# EAGLE schematic schaltplan (EAGLE 6.4)
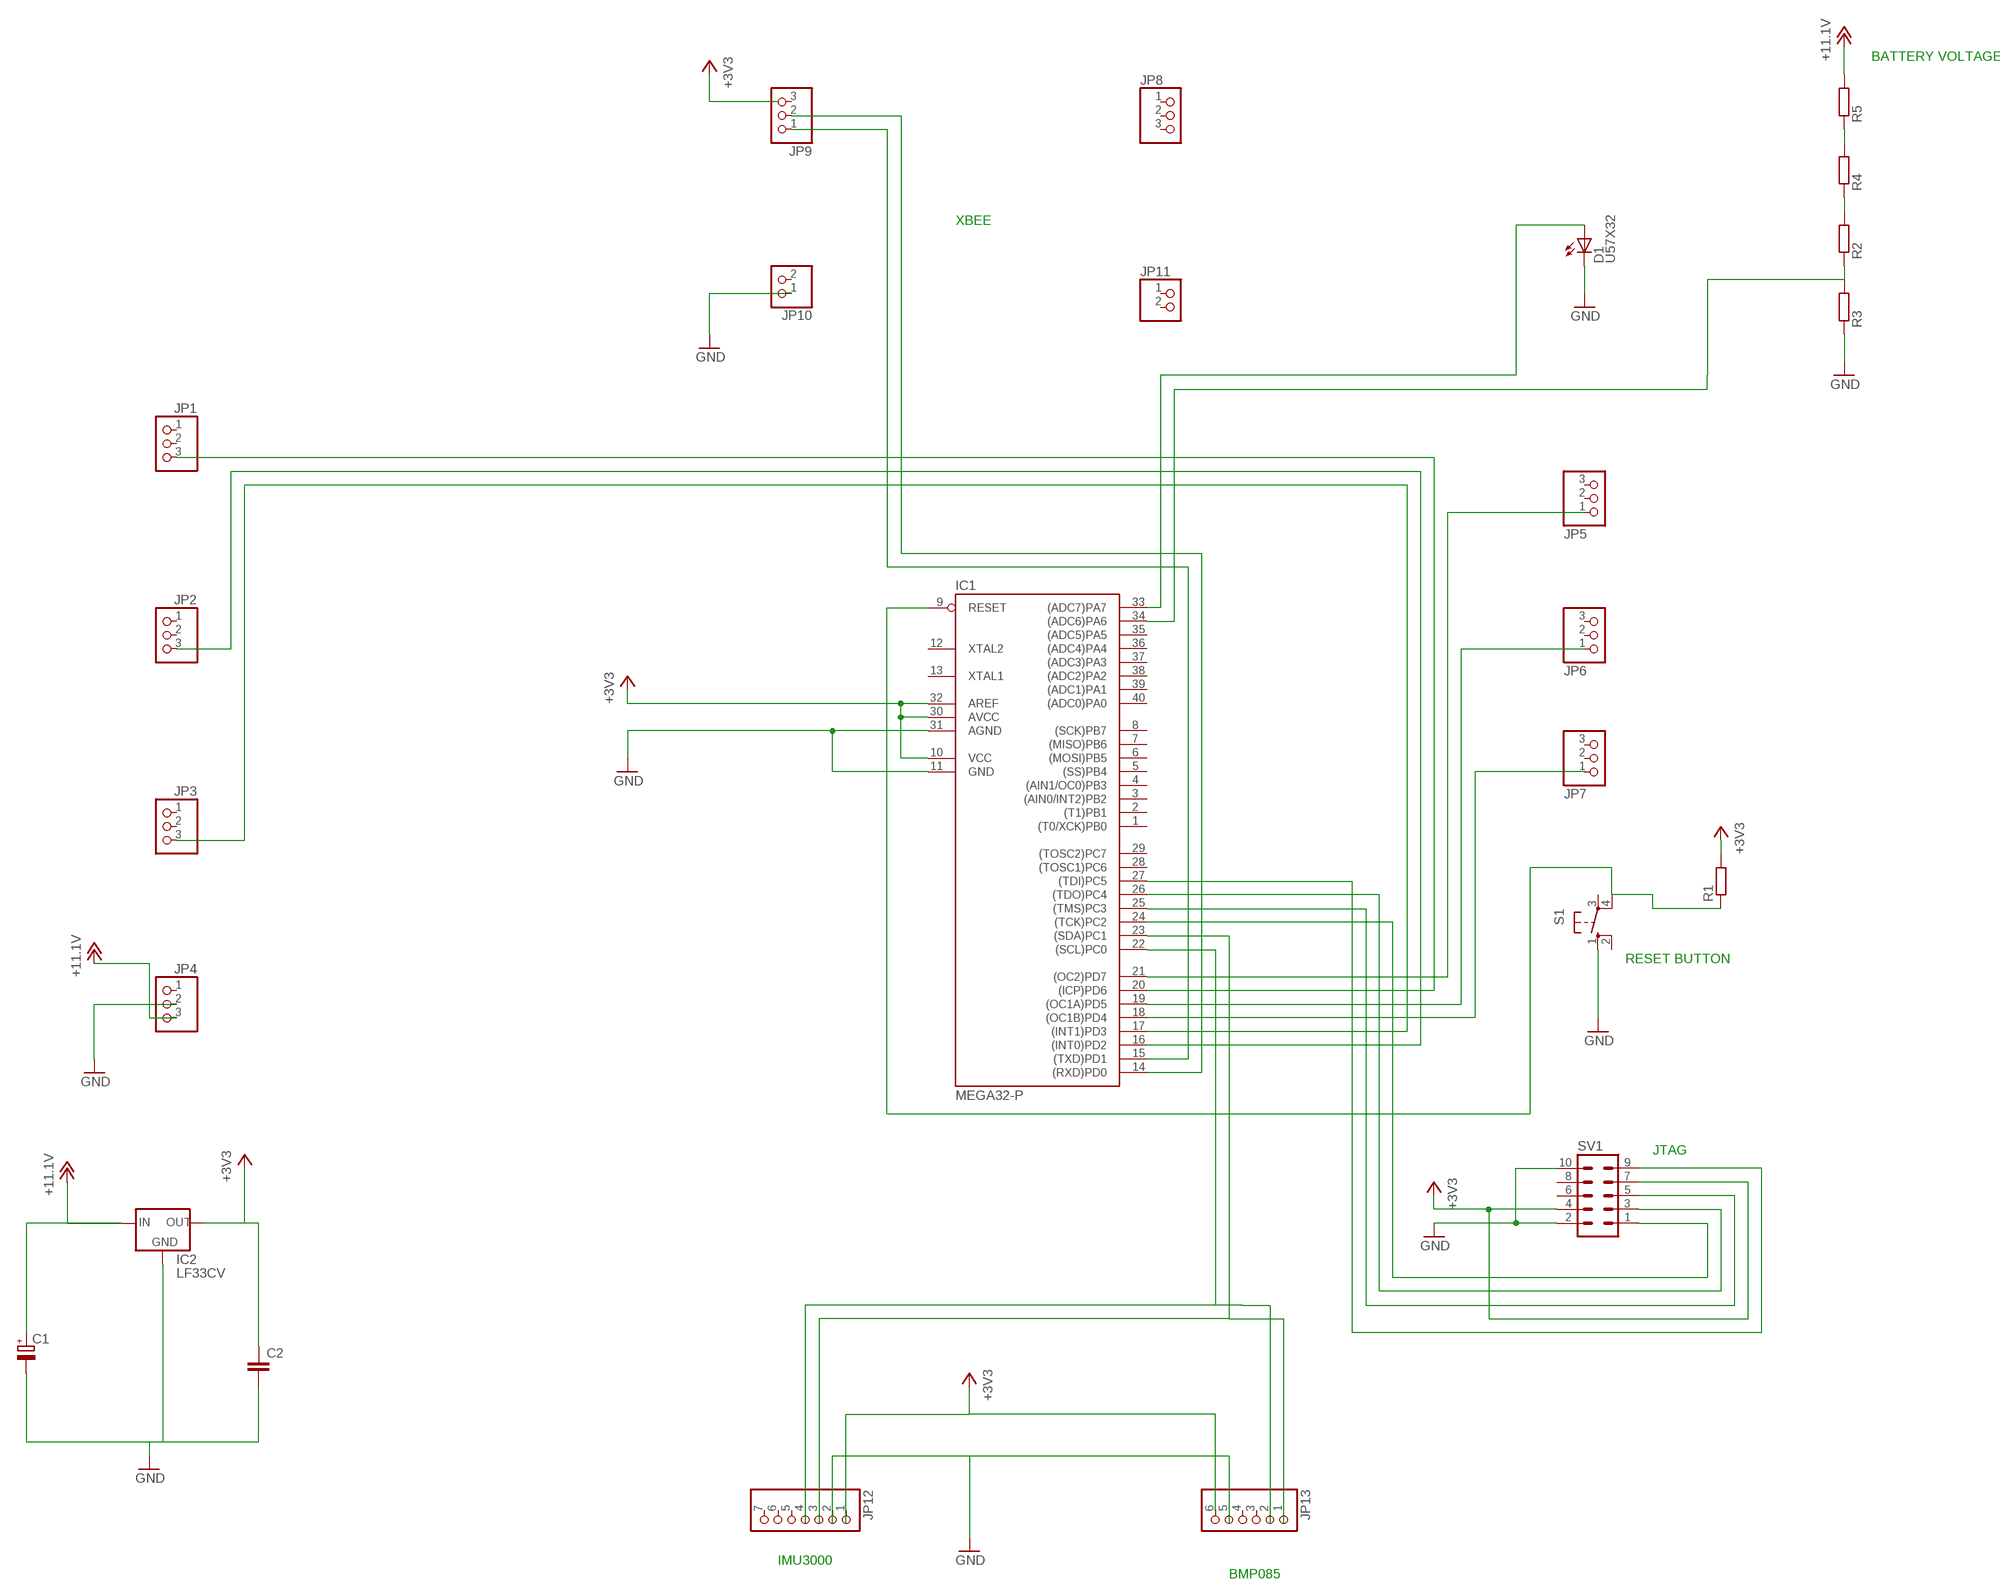
[diagram p0: schematic, sheet 1]

## Parts
C1  CPOL-EU085CS-1AR  [085CS_1AR]
C2  C-EU025-024X044  [C025-024X044]
D1  U57X32  [U57X32]
IC1  MEGA32-P  [DIL40]
IC2  LF33CV  78XXL  [78XXL]
JP1  PINHD-1X3  [1X03]
JP2  PINHD-1X3  [1X03]
JP3  PINHD-1X3  [1X03]
JP4  PINHD-1X3  [1X03]
JP5  PINHD-1X3  [1X03]
JP6  PINHD-1X3  [1X03]
JP7  PINHD-1X3  [1X03]
JP8  PINHD-1X3  [1X03]
JP9  PINHD-1X3  [1X03]
JP10  PINHD-1X2  [1X02]
JP11  PINHD-1X2  [1X02]
JP12  PINHD-1X7  [1X07]
JP13  PINHD-1X6  [1X06]
R1  R-EU_0204/2V  [0204V]
R2  R-EU_0204/2V  [0204V]
R3  R-EU_0204/2V  [0204V]
R4  R-EU_0204/2V  [0204V]
R5  R-EU_0204/2V  [0204V]
S1  40-XX  [B3F-40XX]
SV1  ML10  [ML10]

## Nets
+3V3: C2.1 IC1.10(VCC) IC1.30(AVCC) IC1.32(AREF) IC2.OUT JP13.6 R1.2 SV1.4 SV1.7
+12V: C1.+ IC2.IN JP4.3 R5.2 ; supply symbol labelled +11.1V
GND: C1.- C2.2 D1.K(C) IC1.11(GND) IC1.31(AGND) IC2.GND JP4.2 JP10.1 R3.1 S1.1(S) SV1.2 SV1.10
N$1: IC1.20((ICP)PD6) JP1.3
N$2: IC1.16((INT0)PD2) JP2.3
N$3: IC1.17((INT1)PD3) JP3.3
N$4: IC1.34((ADC6)PA6) R2.1 R3.2
N$5: IC1.24((TCK)PC2) SV1.1
N$6: R2.2 R4.1
N$7: IC1.26((TDO)PC4) SV1.3
N$8: R4.2 R5.1
N$9: IC1.9(RESET) R1.1 S1.4(P1)
N$10: D1.A IC1.33((ADC7)PA7)
N$11: IC1.21((OC2)PD7) JP5.1
N$12: IC1.19((OC1A)PD5) JP6.1
N$13: IC1.18((OC1B)PD4) JP7.1
N$14: IC1.25((TMS)PC3) SV1.5
N$15: IC1.27((TDI)PC5) SV1.9
N$16: IC1.15((TXD)PD1) JP9.1
N$17: IC1.14((RXD)PD0) JP9.2
N$18: IC1.22((SCL)PC0)
N$20: IC1.23((SDA)PC1)
Unconnected: IC1.1((T0/XCK)PB0) IC1.2((T1)PB1) IC1.3((AIN0/INT2)PB2) IC1.4((AIN1/OC0)PB3) IC1.5((SS)PB4) IC1.6((MOSI)PB5) IC1.7((MISO)PB6) IC1.8((SCK)PB7) IC1.12(XTAL2) IC1.13(XTAL1) IC1.28((TOSC1)PC6) IC1.29((TOSC2)PC7) IC1.35((ADC5)PA5) IC1.36((ADC4)PA4) IC1.37((ADC3)PA3) IC1.38((ADC2)PA2) IC1.39((ADC1)PA1) IC1.40((ADC0)PA0) JP1.1 JP1.2 JP2.1 JP2.2 JP3.1 JP3.2 JP4.1 JP5.2 JP5.3 JP6.2 JP6.3 JP7.2 JP7.3 JP8.1 JP8.2 JP8.3 JP9.3 JP10.2 JP11.1 JP11.2 JP12.1 JP12.2 JP12.3 JP12.4 JP12.5 JP12.6 JP12.7 JP13.1 JP13.2 JP13.3 JP13.4 JP13.5 S1.2(S1) S1.3(P) SV1.6 SV1.8

## Notes on the sheet
- BATTERY VOLTAGE
- XBEE
- RESET BUTTON
- JTAG
- IMU3000
- BMP085

## Library data of the parts
C1 = rcl:CPOL-EU: POLARIZED CAPACITOR, European symbol
C2 = rcl:C-EU: CAPACITOR, European symbol
D1 = led:U57X32: LED rectangle, 5.7 x 3.2 mm
IC1 = avr-7:MEGA32-P: MICROCONTROLLER 32 Kbytes FLASH 2 Kbytes SRAM 1 Kbytes EEPROM USART 8-channel 10 bit ADC
IC2 = v-reg:78XXL: VOLTAGE REGULATOR
JP1-JP9 = pinhead:PINHD-1X3: PIN HEADER
JP10 JP11 = pinhead:PINHD-1X2: PIN HEADER
JP12 = pinhead:PINHD-1X7: PIN HEADER
JP13 = pinhead:PINHD-1X6: PIN HEADER
R1-R5 = rcl:R-EU_: RESISTOR, European symbol
S1 = switch-omron:40-XX: OMRON SWITCH; MF: OMRON COMPONENTS USA; MPN: B3F-4000; OC_FARNELL: 176434; OC_NEWARK: 36K3105
SV1 = con-ml:ML10: HARTING; OC_FARNELL: unknown; OC_NEWARK: unknown